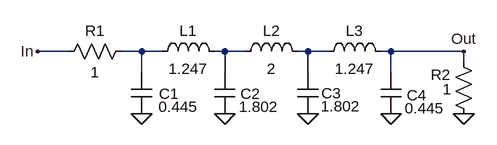
[diagram p0: schematic low_pass_prototype.asc]
low_pass_prototype.asc, the LTspice schematic file:
Version 4
SHEET 1 880 680
WIRE -16 128 -64 128
WIRE 96 128 64 128
WIRE 128 128 96 128
WIRE 224 128 208 128
WIRE 256 128 224 128
WIRE 352 128 336 128
WIRE 384 128 352 128
WIRE 480 128 464 128
WIRE 592 128 480 128
WIRE 592 144 592 128
WIRE 96 160 96 128
WIRE 224 160 224 128
WIRE 352 160 352 128
WIRE 480 160 480 128
FLAG 96 224 0
FLAG 224 224 0
FLAG 352 224 0
FLAG 480 224 0
FLAG 592 224 0
FLAG -64 128 In
FLAG 592 128 Out
SYMBOL res 80 112 R90
WINDOW 0 0 56 VBottom 2
WINDOW 3 32 56 VTop 2
SYMATTR InstName R1
SYMATTR Value 1
SYMBOL res 608 240 R180
WINDOW 0 36 76 Left 2
WINDOW 3 35 54 Left 2
SYMATTR InstName R2
SYMATTR Value 1
SYMBOL ind 112 144 R270
WINDOW 0 32 56 VTop 2
WINDOW 3 5 56 VBottom 2
SYMATTR InstName L1
SYMATTR Value 1.247
SYMBOL ind 240 144 R270
WINDOW 0 32 56 VTop 2
WINDOW 3 5 56 VBottom 2
SYMATTR InstName L2
SYMATTR Value 2
SYMBOL ind 368 144 R270
WINDOW 0 32 56 VTop 2
WINDOW 3 5 56 VBottom 2
SYMATTR InstName L3
SYMATTR Value 1.247
SYMBOL cap 336 160 R0
WINDOW 0 37 32 Left 2
WINDOW 3 36 52 Left 2
SYMATTR InstName C3
SYMATTR Value 1.802
SYMBOL cap 208 160 R0
WINDOW 0 40 33 Left 2
WINDOW 3 38 53 Left 2
SYMATTR InstName C2
SYMATTR Value 1.802
SYMBOL cap 80 160 R0
WINDOW 0 43 33 Left 2
WINDOW 3 42 53 Left 2
SYMATTR InstName C1
SYMATTR Value 0.445
SYMBOL cap 464 160 R0
WINDOW 0 40 35 Left 2
WINDOW 3 37 55 Left 2
SYMATTR InstName C4
SYMATTR Value 0.445

The netlist it stands for:
* low_pass_prototype.asc
R1 N001 In 1
R2 0 Out 1
L1 N001 N002 1.247
L2 N002 N003 2
L3 N003 Out 1.247
C3 N003 0 1.802
C2 N002 0 1.802
C1 N001 0 0.445
C4 Out 0 0.445
.backanno
.end